# EAGLE design CrowPanel ESP32 Display-2.9(E) Inch (EAGLE 9.6.2)
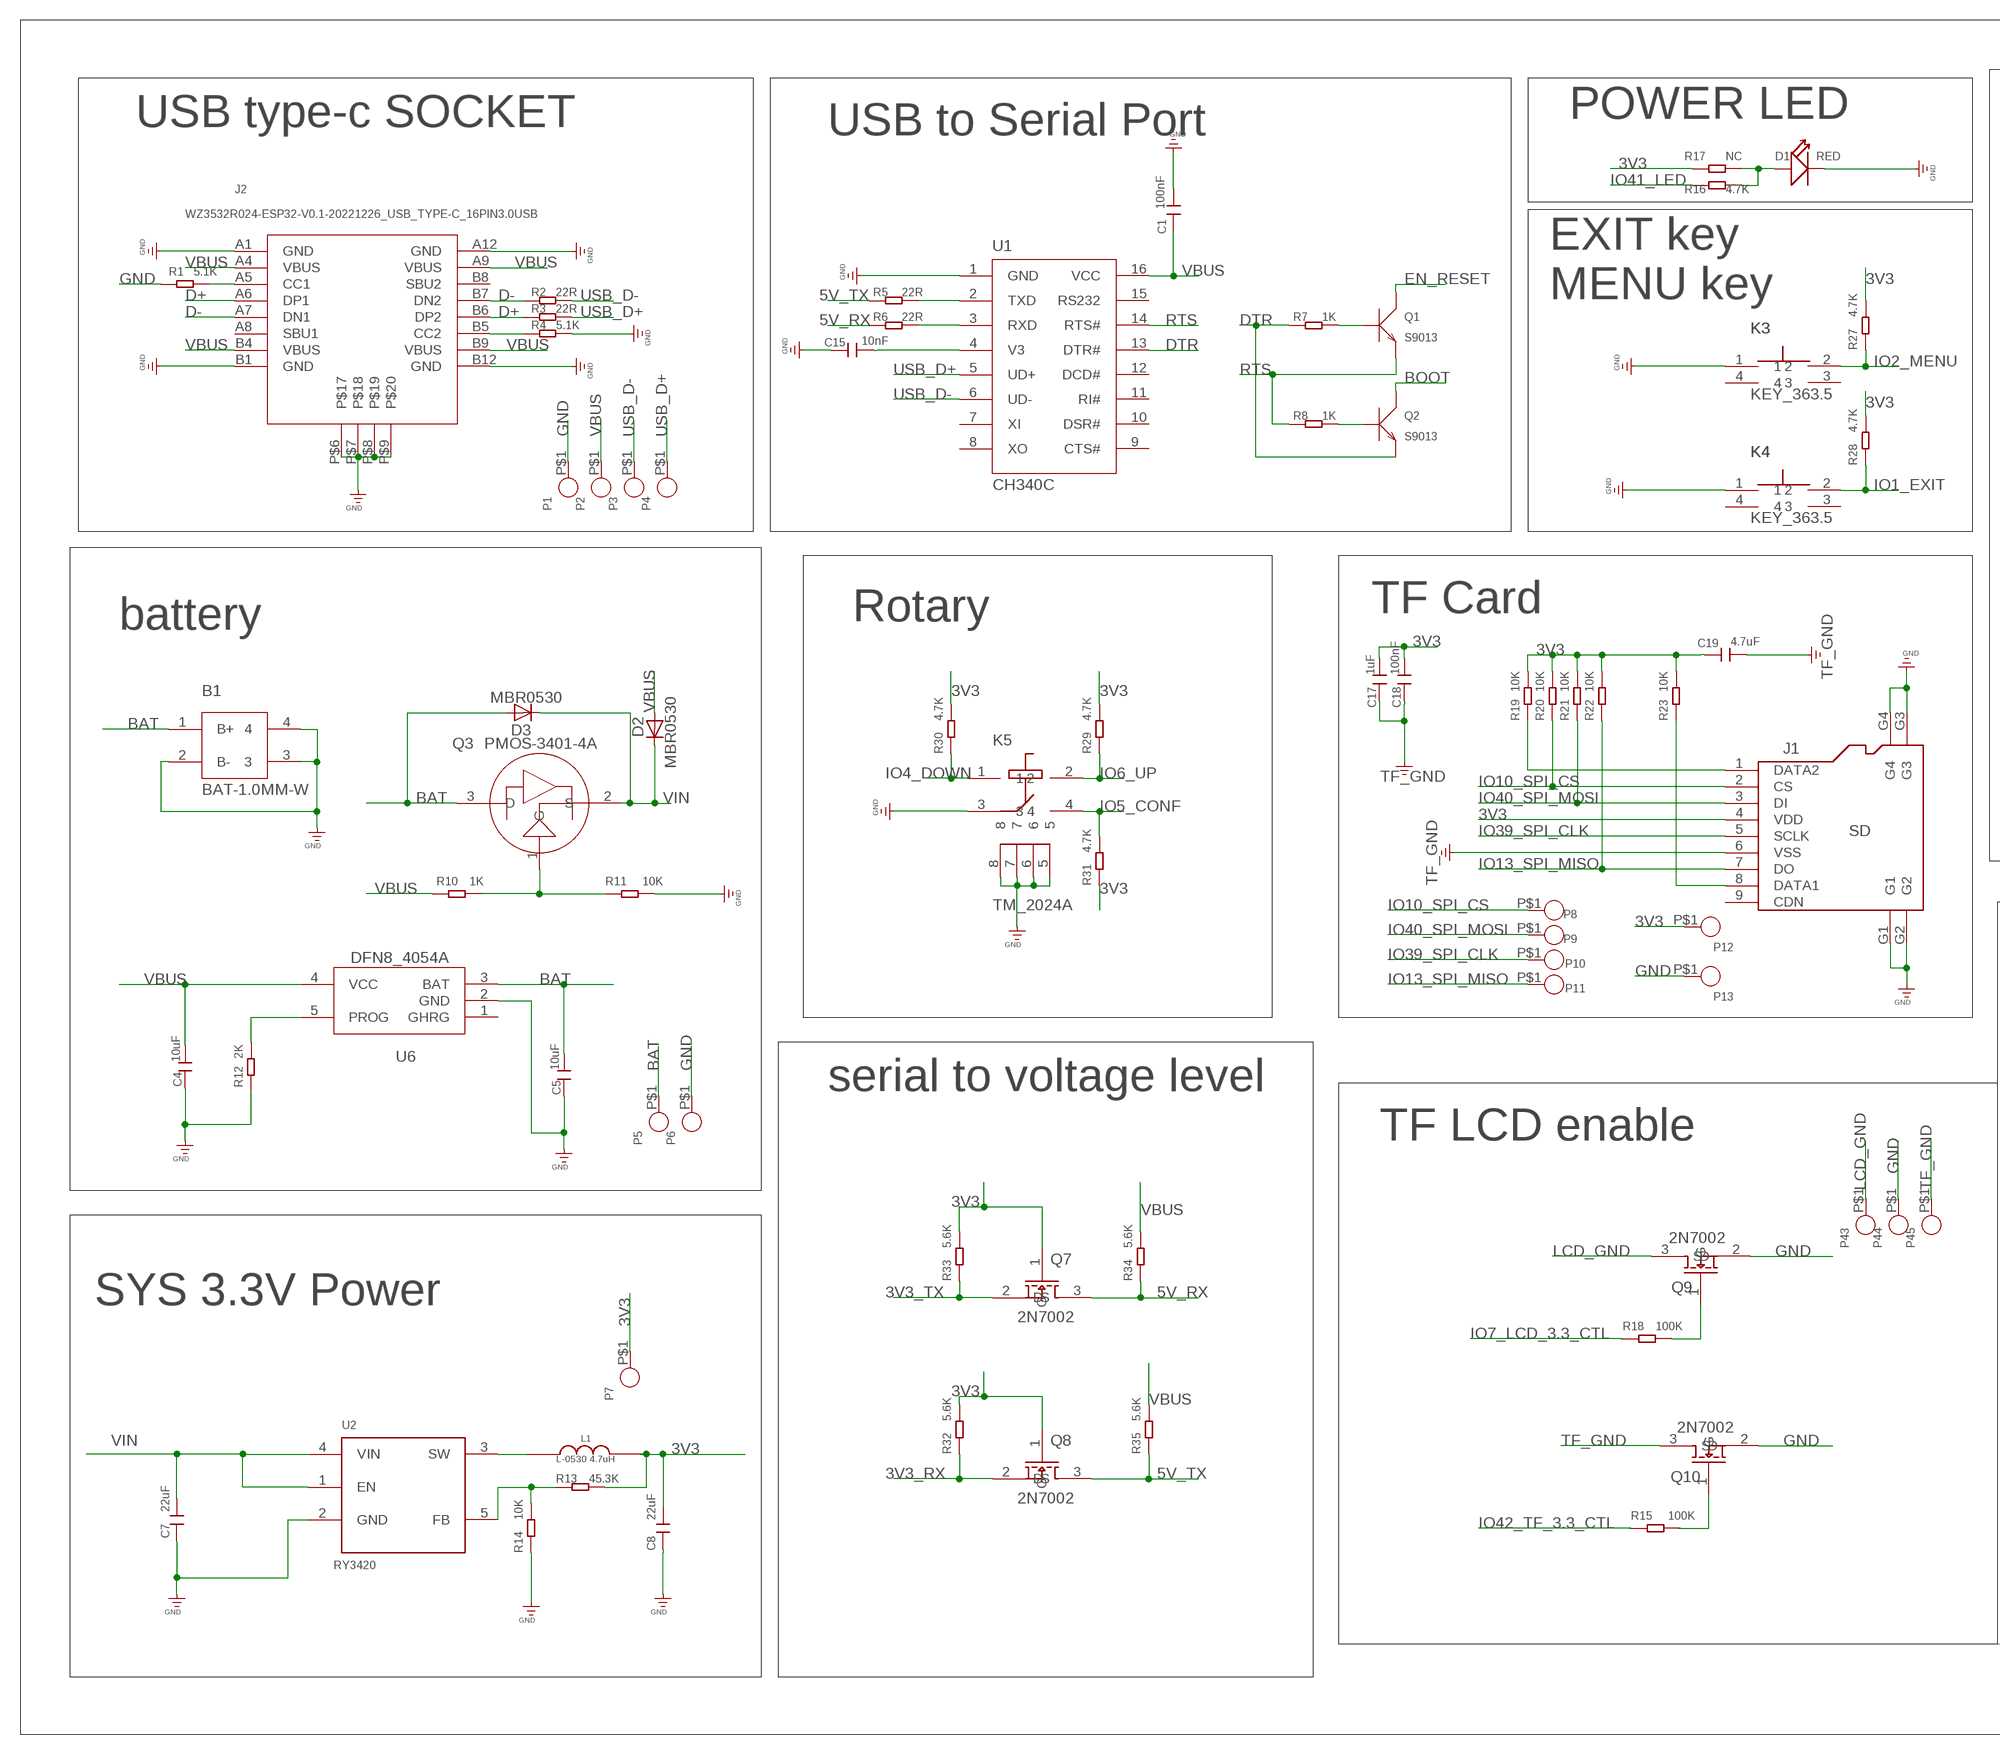
[diagram p0: schematic, sheet 1, part 1 of 2]
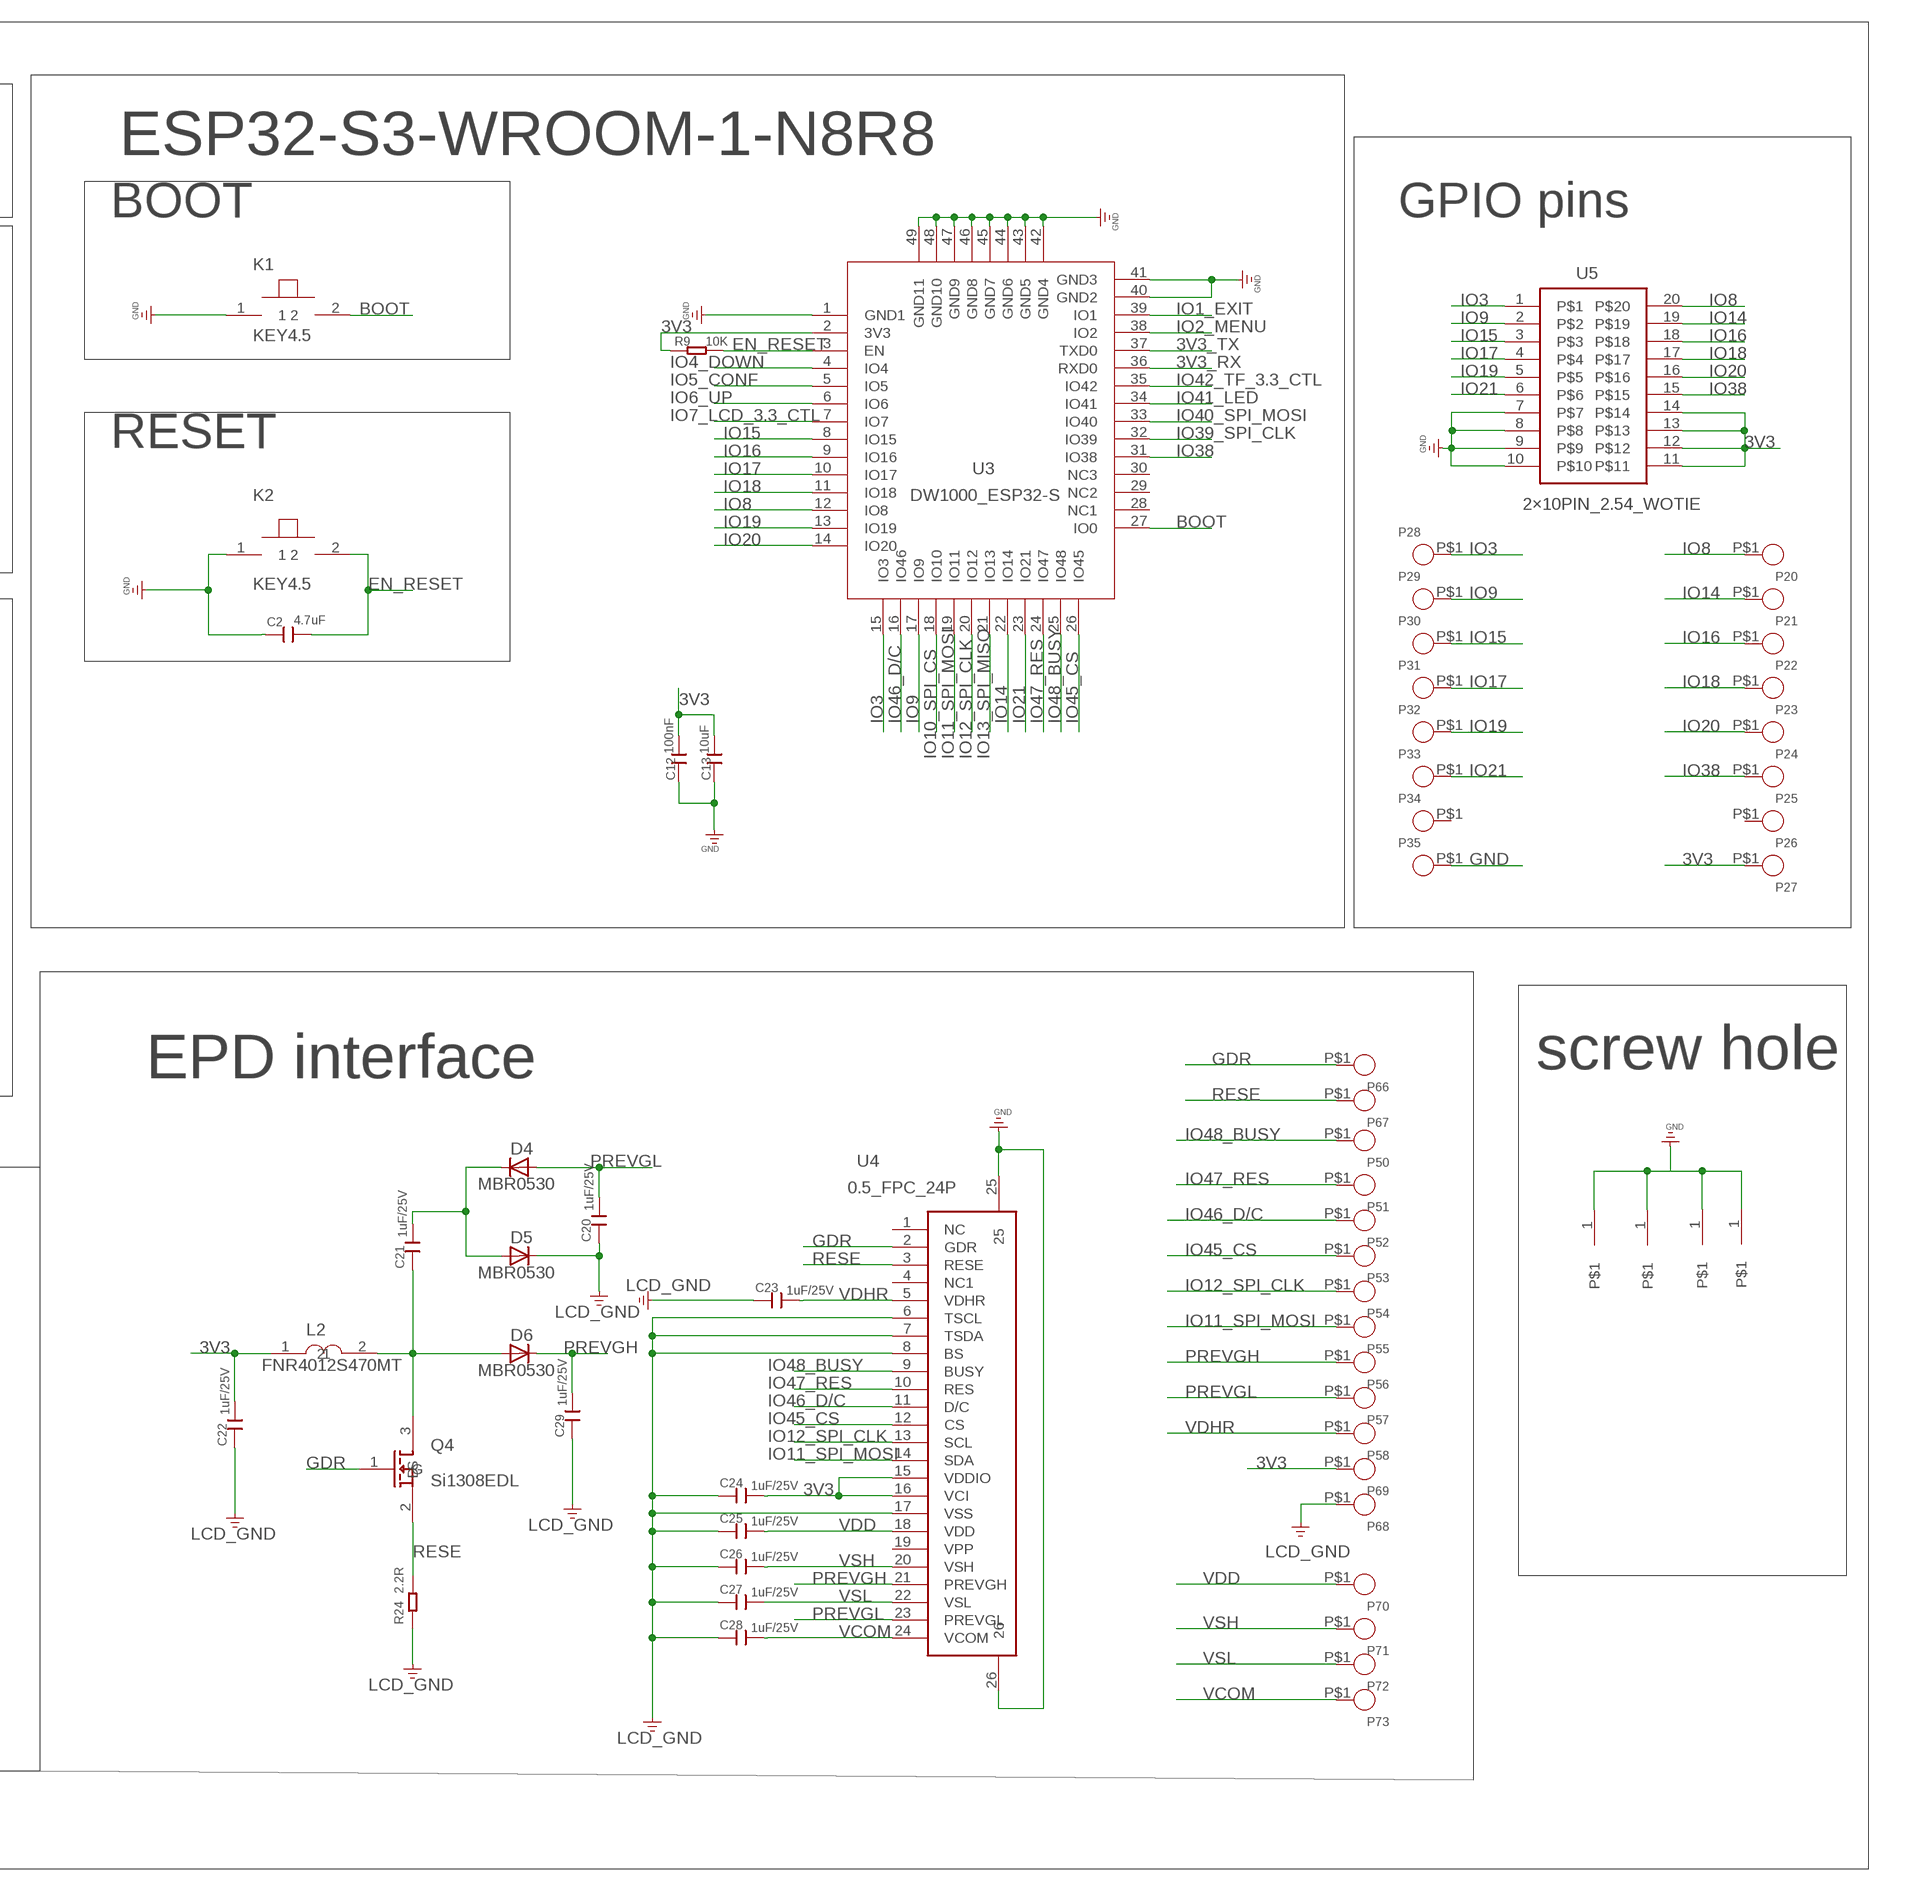
[diagram p1: schematic, sheet 1, part 2 of 2]

## Parts
B1  BAT-1.0MM-W  [SH1.0MM-W]
C1  100nF  C0402_W  [0402]
C2  4.7uF  C0402_W  [0402]
C4  10uF  C0402_W  [0402]
C5  10uF  C0402_W  [0402]
C7  22uF  C0603  [0603]
C8  22uF  C0603  [0603]
C12  100nF  C0402_W  [0402]
C13  10uF  C0402_W  [0402]
C15  10nF  C0402_W  [0402]
C17  1uF  C0402_W  [0402]
C18  100nF  C0402_W  [0402]
C19  4.7uF  C0402_W  [0402]
C20  1uF/25V  C0402_W  [0402]
C21  1uF/25V  C0402_W  [0402]
C22  1uF/25V  C0402_W  [0402]
C23  1uF/25V  C0402_W  [0402]
C24  1uF/25V  C0402_W  [0402]
C25  1uF/25V  C0402_W  [0402]
C26  1uF/25V  C0402_W  [0402]
C27  1uF/25V  C0402_W  [0402]
C28  1uF/25V  C0402_W  [0402]
C29  1uF/25V  C0402_W  [0402]
D1  RED  A_XBJ_DISCRETE_LED0603  [A_XBJ_DISCRETE_LED-0603]
D2  MBR0530  DIODE_DIODE-SOD123  [DIODE_SOD123]
D3  MBR0530  DIODE_DIODE-SOD123  [DIODE_SOD123]
D4  MBR0530  DIODE_DIODE-SOD123  [DIODE_SOD123]
D5  MBR0530  DIODE_DIODE-SOD123  [DIODE_SOD123]
D6  MBR0530  DIODE_DIODE-SOD123  [DIODE_SOD123]
H1  DW1000_3.2MM-5  [DW1000_3.2MM-5]
H2  DW1000_3.2MM-5  [DW1000_3.2MM-5]
H3  DW1000_3.2MM-5  [DW1000_3.2MM-5]
H4  DW1000_3.2MM-5  [DW1000_3.2MM-5]
J1  SD  CONNECTOR_HOLDER-MICROSD-9P  [CONNECTOR_9P-SMD-W/-RING]
J2  WZ3532R024-ESP32-V0.1-20221226_USB_TYPE-C_16PIN3.0USB  [WZ3532R024-ESP32-V0.1-20221226_KEVIN_3.0TYPEC-SMD]
K1  KEY4.5  [KEY-4.5]
K2  KEY4.5  [KEY-4.5]
K3  KEY_363.5  [KEY_3*6*3.5]
K4  KEY_363.5  [KEY_3*6*3.5]
K5  TM_2024A  [TM_2024A]
L1  L-0530 4.7uH  L-0530  [L0530]
L2  FNR4012S470MT  [FNR4012S470MT]
P1  CROWPI_POW_PADPAD-1.0MM  [CROWPI_POW_PAD-1.0MM]
P2  CROWPI_POW_PADPAD-1.0MM  [CROWPI_POW_PAD-1.0MM]
P3  CROWPI_POW_PADPAD-1.0MM  [CROWPI_POW_PAD-1.0MM]
P4  CROWPI_POW_PADPAD-1.0MM  [CROWPI_POW_PAD-1.0MM]
P5  CROWPI_POW_PADPAD-1.0MM  [CROWPI_POW_PAD-1.0MM]
P6  CROWPI_POW_PADPAD-1.0MM  [CROWPI_POW_PAD-1.0MM]
P7  CROWPI_POW_PADPAD-1.0MM  [CROWPI_POW_PAD-1.0MM]
P8  CROWPI_POW_PADPAD-1.0MM  [CROWPI_POW_PAD-1.0MM]
P9  CROWPI_POW_PADPAD-1.0MM  [CROWPI_POW_PAD-1.0MM]
P10  CROWPI_POW_PADPAD-1.0MM  [CROWPI_POW_PAD-1.0MM]
P11  CROWPI_POW_PADPAD-1.0MM  [CROWPI_POW_PAD-1.0MM]
P12  CROWPI_POW_PADPAD-1.0MM  [CROWPI_POW_PAD-1.0MM]
P13  CROWPI_POW_PADPAD-1.0MM  [CROWPI_POW_PAD-1.0MM]
P20  CROWPI_POW_PADPAD-1.0MM  [CROWPI_POW_PAD-1.0MM]
P21  CROWPI_POW_PADPAD-1.0MM  [CROWPI_POW_PAD-1.0MM]
P22  CROWPI_POW_PADPAD-1.0MM  [CROWPI_POW_PAD-1.0MM]
P23  CROWPI_POW_PADPAD-1.0MM  [CROWPI_POW_PAD-1.0MM]
P24  CROWPI_POW_PADPAD-1.0MM  [CROWPI_POW_PAD-1.0MM]
P25  CROWPI_POW_PADPAD-1.0MM  [CROWPI_POW_PAD-1.0MM]
P26  CROWPI_POW_PADPAD-1.0MM  [CROWPI_POW_PAD-1.0MM]
P27  CROWPI_POW_PADPAD-1.0MM  [CROWPI_POW_PAD-1.0MM]
P28  CROWPI_POW_PADPAD-1.0MM  [CROWPI_POW_PAD-1.0MM]
P29  CROWPI_POW_PADPAD-1.0MM  [CROWPI_POW_PAD-1.0MM]
P30  CROWPI_POW_PADPAD-1.0MM  [CROWPI_POW_PAD-1.0MM]
P31  CROWPI_POW_PADPAD-1.0MM  [CROWPI_POW_PAD-1.0MM]
P32  CROWPI_POW_PADPAD-1.0MM  [CROWPI_POW_PAD-1.0MM]
P33  CROWPI_POW_PADPAD-1.0MM  [CROWPI_POW_PAD-1.0MM]
P34  CROWPI_POW_PADPAD-1.0MM  [CROWPI_POW_PAD-1.0MM]
P35  CROWPI_POW_PADPAD-1.0MM  [CROWPI_POW_PAD-1.0MM]
P43  CROWPI_POW_PADPAD-1.0MM  [CROWPI_POW_PAD-1.0MM]
P44  CROWPI_POW_PADPAD-1.0MM  [CROWPI_POW_PAD-1.0MM]
P45  CROWPI_POW_PADPAD-1.0MM  [CROWPI_POW_PAD-1.0MM]
P50  CROWPI_POW_PADPAD-1.0MM  [CROWPI_POW_PAD-1.0MM]
P51  CROWPI_POW_PADPAD-1.0MM  [CROWPI_POW_PAD-1.0MM]
P52  CROWPI_POW_PADPAD-1.0MM  [CROWPI_POW_PAD-1.0MM]
P53  CROWPI_POW_PADPAD-1.0MM  [CROWPI_POW_PAD-1.0MM]
P54  CROWPI_POW_PADPAD-1.0MM  [CROWPI_POW_PAD-1.0MM]
P55  CROWPI_POW_PADPAD-1.0MM  [CROWPI_POW_PAD-1.0MM]
P56  CROWPI_POW_PADPAD-1.0MM  [CROWPI_POW_PAD-1.0MM]
P57  CROWPI_POW_PADPAD-1.0MM  [CROWPI_POW_PAD-1.0MM]
P58  CROWPI_POW_PADPAD-1.0MM  [CROWPI_POW_PAD-1.0MM]
P66  CROWPI_POW_PADPAD-1.0MM  [CROWPI_POW_PAD-1.0MM]
P67  CROWPI_POW_PADPAD-1.0MM  [CROWPI_POW_PAD-1.0MM]
P68  CROWPI_POW_PADPAD-1.0MM  [CROWPI_POW_PAD-1.0MM]
P69  CROWPI_POW_PADPAD-1.0MM  [CROWPI_POW_PAD-1.0MM]
P70  CROWPI_POW_PADPAD-1.0MM  [CROWPI_POW_PAD-1.0MM]
P71  CROWPI_POW_PADPAD-1.0MM  [CROWPI_POW_PAD-1.0MM]
P72  CROWPI_POW_PADPAD-1.0MM  [CROWPI_POW_PAD-1.0MM]
P73  CROWPI_POW_PADPAD-1.0MM  [CROWPI_POW_PAD-1.0MM]
Q1  S9013  DISCRETE_TRANSISTOR-NPN-SOT23  [DISCRETE_SOT23$1]
Q2  S9013  DISCRETE_TRANSISTOR-NPN-SOT23  [DISCRETE_SOT23$1]
Q3  PMOS-3401-4A  DFN8_P-MOS-SOT23  [DFN8_SOT-23]
Q4  Si1308EDL  HXY2102EI  [SOT-323_W]
Q7  2N7002  NMOS_W  [SOT23-3_W]
Q8  2N7002  NMOS_W  [SOT23-3_W]
Q9  2N7002  NMOS_W  [SOT23-3_W]
Q10  2N7002  NMOS_W  [SOT23-3_W]
R1  5.1K  R0402-1  [0402]
R2  22R  R0402-1  [0402]
R3  22R  R0402-1  [0402]
R4  5.1K  R0402-1  [0402]
R5  22R  R0402-1  [0402]
R6  22R  R0402-1  [0402]
R7  1K  R0402-1  [0402]
R8  1K  R0402-1  [0402]
R9  10K  R0402-1  [0402]
R10  1K  R0402-1  [0402]
R11  10K  R0402-1  [0402]
R12  2K  R0402-1  [0402]
R13  45.3K  R0402-1  [0402]
R14  10K  R0402-1  [0402]
R15  100K  R0402-1  [0402]
R16  4.7K  A9G_DISCRETE_R-0603  [A9G_DISCRETE_R0603]
R17  NC  A9G_DISCRETE_R-0603  [A9G_DISCRETE_R0603]
R18  100K  R0402-1  [0402]
R19  10K  R0402-1  [0402]
R20  10K  R0402-1  [0402]
R21  10K  R0402-1  [0402]
R22  10K  R0402-1  [0402]
R23  10K  R0402-1  [0402]
R24  2.2R  R0402-1  [0402]
R27  4.7K  A9G_DISCRETE_R-0603  [A9G_DISCRETE_R0603]
R28  4.7K  A9G_DISCRETE_R-0603  [A9G_DISCRETE_R0603]
R29  4.7K  A9G_DISCRETE_R-0603  [A9G_DISCRETE_R0603]
R30  4.7K  A9G_DISCRETE_R-0603  [A9G_DISCRETE_R0603]
R31  4.7K  A9G_DISCRETE_R-0603  [A9G_DISCRETE_R0603]
R32  5.6K  R0402-1  [0402]
R33  5.6K  R0402-1  [0402]
R34  5.6K  R0402-1  [0402]
R35  5.6K  R0402-1  [0402]
U1  CH340C  A_XBJ_CH340G  [A_XBJ_SOP-16]
U2  RY3420  CROWBOT_-V1.0-20220525_A_XBJ_HM3420B  [CROWBOT_-V1.0-20220525_A_XBJ_SOT23-5]
U3  DW1000_ESP32-S  [DW1000_ESP32-S3]
U4  0.5_FPC_24P  [0.5_FPC_24P]
U5  2×10PIN_2.54_WOTIE  [2*10PIN_2.54_WOTIE]
U6  DFN8_4054A  [DFN8_SOP23-5]

## Nets
3V3: C8.2 C12.2 C13.2 C17.2 C18.2 C19.1 C22.1 C24.1 J1.4(VDD) L1.P$2 L2.1 P7.P$1 P12.P$1 P27.P$1 P69.P$1 Q7.1(G) Q8.1(G) R9.1 R13.2 R17.1 R19.2 R20.2 R21.2 R22.2 R23.2 R27.2 R28.2 R29.2 R30.2 R31.1 R32.2 R33.2 U3.2(3V3) U4.15(VDDIO) U4.16(VCI) U5.11 U5.12 U5.13 U5.14
3V3_RX: Q8.2(S) R32.1 U3.36(RXD0)
3V3_TX: Q7.2(S) R33.1 U3.37(TXD0)
5V_RX: Q7.3(D) R6.1 R34.1
5V_TX: Q8.3(D) R5.1 R35.1
BAT: B1.1(B+) C5.2 D3.A P5.P$1 Q3.3(D) U6.3(BAT)
BOOT: K1.2 Q2.3(C) U3.27(IO0)
D+: J2.A6(DP1) J2.B6(DP2) R3.1
D-: J2.A7(DN1) J2.B7(DN2) R2.1
DTR: Q2.2(E) R7.1 U1.13(DTR#)
EN_RESET: C2.2 K2.2 Q1.3(C) R9.2 U3.3(EN)
GDR: P66.P$1 Q4.1(G) U4.2(GDR)
GND: B1.2(B-) B1.3 B1.4 C1.2 C2.1 C4.1 C5.1 C7.1 C8.1 C12.1 C13.1 C15.1 D1.- H1.1 H2.1 H3.1 H4.1 J1.G1 J1.G2 J1.G3 J1.G4 J2.A1(GND) J2.A12(GND) J2.B1(GND) J2.B12(GND) J2.P$6 J2.P$7 J2.P$8 J2.P$9 K1.1 K2.1 K3.1 K4.1 K5.3 K5.5 K5.6 K5.7 K5.8 P1.P$1 P6.P$1 P13.P$1 P35.P$1 P44.P$1 Q9.2(S) Q10.2(S) R1.1 R4.2 R11.2 R12.1 R14.1 U1.1(GND) U2.2(GND) U3.1(GND1) U3.40(GND2) U3.41(GND3) U3.42(GND4) U3.43(GND5) U3.44(GND6) U3.45(GND7) U3.46(GND8) U3.47(GND9) U3.48(GND10) U3.49(GND11) U4.25 U4.26 U5.7 U5.8 U5.9 U5.10 U6.2(GND)
IO1_EXIT: K4.2 R28.1 U3.39(IO1)
IO2_MENU: K3.2 R27.1 U3.38(IO2)
IO3: P28.P$1 U3.15(IO3) U5.1
IO4_DOWN: K5.1 R30.1 U3.4(IO4)
IO5_CONF: K5.4 R31.2 U3.5(IO5)
IO6_UP: K5.2 R29.1 U3.6(IO6)
IO7_LCD_3.3_CTL: R18.1 U3.7(IO7)
IO8: P20.P$1 U3.12(IO8) U5.20
IO9: P29.P$1 U3.17(IO9) U5.2
IO10_SPI_CS: J1.2(CS) P8.P$1 R20.1 U3.18(IO10)
IO11_SPI_MOSI: P55.P$1 U3.19(IO11) U4.14(SDA)
IO12_SPI_CLK: P54.P$1 U3.20(IO12) U4.13(SCL)
IO13_SPI_MISO: J1.7(DO) P11.P$1 R22.1 U3.21(IO13)
IO14: P21.P$1 U3.22(IO14) U5.19
IO15: P30.P$1 U3.8(IO15) U5.3
IO16: P22.P$1 U3.9(IO16) U5.18
IO17: P31.P$1 U3.10(IO17) U5.4
IO18: P23.P$1 U3.11(IO18) U5.17
IO19: P32.P$1 U3.13(IO19) U5.5
IO20: P24.P$1 U3.14(IO20) U5.16
IO21: P33.P$1 U3.23(IO21) U5.6
IO38: P25.P$1 U3.31(IO38) U5.15
IO39_SPI_CLK: J1.5(SCLK) P10.P$1 U3.32(IO39)
IO40_SPI_MOSI: J1.3(DI) P9.P$1 R21.1 U3.33(IO40)
IO41_LED: R16.1 U3.34(IO41)
IO42_TF_3.3_CTL: R15.1 U3.35(IO42)
IO45_CS: P53.P$1 U3.26(IO45) U4.12(CS)
IO46_D/C: P52.P$1 U3.16(IO46) U4.11(D/C)
IO47_RES: P51.P$1 U3.24(IO47) U4.10(RES)
IO48_BUSY: P50.P$1 U3.25(IO48) U4.9(BUSY)
LCD_GND: C20.2 C22.2 C23.2 C24.2 C25.2 C26.2 C27.2 C28.2 C29.2 D5.C P43.P$1 P68.P$1 Q9.3(D) R24.1 U4.6(TSCL) U4.7(TSDA) U4.8(BS) U4.17(VSS) ; supply symbol labelled GND
N$1: Q1.1(B) R7.2
N$2: R5.2 U1.2(TXD)
N$3: R6.2 U1.3(RXD)
N$4: Q2.1(B) R8.2
N$5: J2.A5(CC1) R1.2
N$6: Q3.1(G) R10.2 R11.1
N$7: Q9.1(G) R18.2
N$8: Q10.1(G) R15.2
N$9: R13.1 R14.2 U2.5(FB)
N$10: J1.1(DATA2) R19.1
N$11: L1.P$1 U2.3(SW)
N$12: J2.B5(CC2) R4.1
N$13: C15.2 U1.4(V3)
N$16: R12.2 U6.5(PROG)
N$20: J1.8(DATA1) R23.1
N$25: D1.+ R16.2 R17.2
N$55: C21.1 D4.C D5.A
N$56: C21.2 D6.A L2.2 Q4.3(D)
PREVGH: C29.1 D6.C P56.P$1 U4.21(PREVGH)
PREVGL: C20.1 D4.A P57.P$1 U4.23(PREVGL)
RESE: P67.P$1 Q4.2(S) R24.2 U4.3(RESE)
RTS: Q1.2(E) R8.1 U1.14(RTS#)
TF_GND: C17.1 C18.1 C19.2 J1.6(VSS) P45.P$1 Q10.3(D) ; supply symbol labelled GND
USB_D+: P4.P$1 R3.2 U1.5(UD+)
USB_D-: P3.P$1 R2.2 U1.6(UD-)
VBUS: C1.1 C4.2 D2.A J2.A4(VBUS) J2.A9(VBUS) J2.B4(VBUS) J2.B9(VBUS) P2.P$1 R10.1 R34.2 R35.2 U1.16(VCC) U6.4(VCC)
VCOM: C28.1 P73.P$1 U4.24(VCOM)
VDD: C25.1 P70.P$1 U4.18(VDD)
VDHR: C23.1 P58.P$1 U4.5(VDHR)
VIN: C7.2 D2.C D3.C Q3.2(S) U2.1(EN) U2.4(VIN)
VSH: C26.1 P71.P$1 U4.20(VSH)
VSL: C27.1 P72.P$1 U4.22(VSL)
Unconnected: J1.9(CDN) J2.A8(SBU1) J2.B8(SBU2) K3.3 K3.4 K4.3 K4.4 P26.P$1 P34.P$1 U1.7(XI) U1.8(XO) U1.9(CTS#) U1.10(DSR#) U1.11(RI#) U1.12(DCD#) U1.15(RS232) U3.28(NC1) U3.29(NC2) U3.30(NC3) U4.1(NC) U4.4(NC1) U4.19(VPP) U6.1(GHRG)

## Notes on the sheet
- USB type-c SOCKET | POWER LED
- USB to Serial Port | ESP32-S3-WROOM-1-N8R8
- BOOT | GPIO pins
- EXIT key
  MENU key
- RESET
- Rotary | TF Card
- battery
- EPD interface | screw hole
- serial to voltage level
- TF LCD enable
- SYS 3.3V Power

## Library data of the parts
B1 = WGH:BAT-1.0MM-W
C1 C2 C4 C5 C12 C13 C15 C17-C29 = WGH:C0402_W
C7 C8 = WGH:C0603
D1 = CrowPanel ESP32 Display-4.3-inch-V2.1-20240314:A_XBJ_DISCRETE_LED*
D2-D6 = CrowPanel ESP32 Display-4.3-inch-V2.1-20240314:DIODE_DIODE-: DIODE
H1-H4 = ESP32 Terminal - 3.5 Inch_2.0:DW1000_3.2MM-5
J1 = CrowPanel ESP32 Display-4.3-inch-V2.1-20240314:CONNECTOR_HOLDER-MICROSD-9P
J2 = CrowPanel ESP32 Display-4.3-inch-V2.1-20240314:WZ3532R024-ESP32-V0.1-20221226_USB_TYPE-C_16PIN
K1 K2 = WGH:KEY4.5
K3 K4 = WGH:KEY_3*6*3.5
K5 = WGH:TM_2024A
L1 = CrowPanel ESP32 Display-4.3-inch-V2.1-20240314:L-0530
L2 = WGH:FNR4012S470MT
P1-P13 P20-P35 P43-P45 P50-P58 P66-P73 = ESP32 Terminal - 3.5 Inch_2.0:CROWPI_POW_PAD*
Q1 Q2 = CrowPanel ESP32 Display-4.3-inch-V2.1-20240314:DISCRETE_TRANSISTOR-NPN*: NPN audion
Q3 = CrowPanel ESP32 Display-4.3-inch-V2.1-20240314:DFN8_P-MOS-SOT23
Q4 = WGH:HXY2102EI
Q7-Q10 = WGH:NMOS_W
R1-R15 R18-R24 R32-R35 = WGH:R0402-1
R16 R17 R27-R31 = CrowPanel ESP32 Display-4.3-inch-V2.1-20240314:A9G_DISCRETE_R*
U1 = CrowPanel ESP32 Display-4.3-inch-V2.1-20240314:A_XBJ_CH340G
U2 = CrowPanel ESP32 Display-4.3-inch-V2.1-20240314:CROWBOT_-V1.0-20220525_A_XBJ_HM3420B
U3 = CrowPanel ESP32 Display-4.3-inch-V2.1-20240314:DW1000_ESP32-S
U4 = ESP32 Terminal - 3.5 Inch_2.0:0.5_FPC_24P
U5 = WGH:2×10PIN_2.54_WOTIE
U6 = CrowPanel ESP32 Display-4.3-inch-V2.1-20240314:DFN8_4054A

## Net classes
0 default: width 0.254 mm, drill 0.305 mm, clearance 0.152 mm

## Board
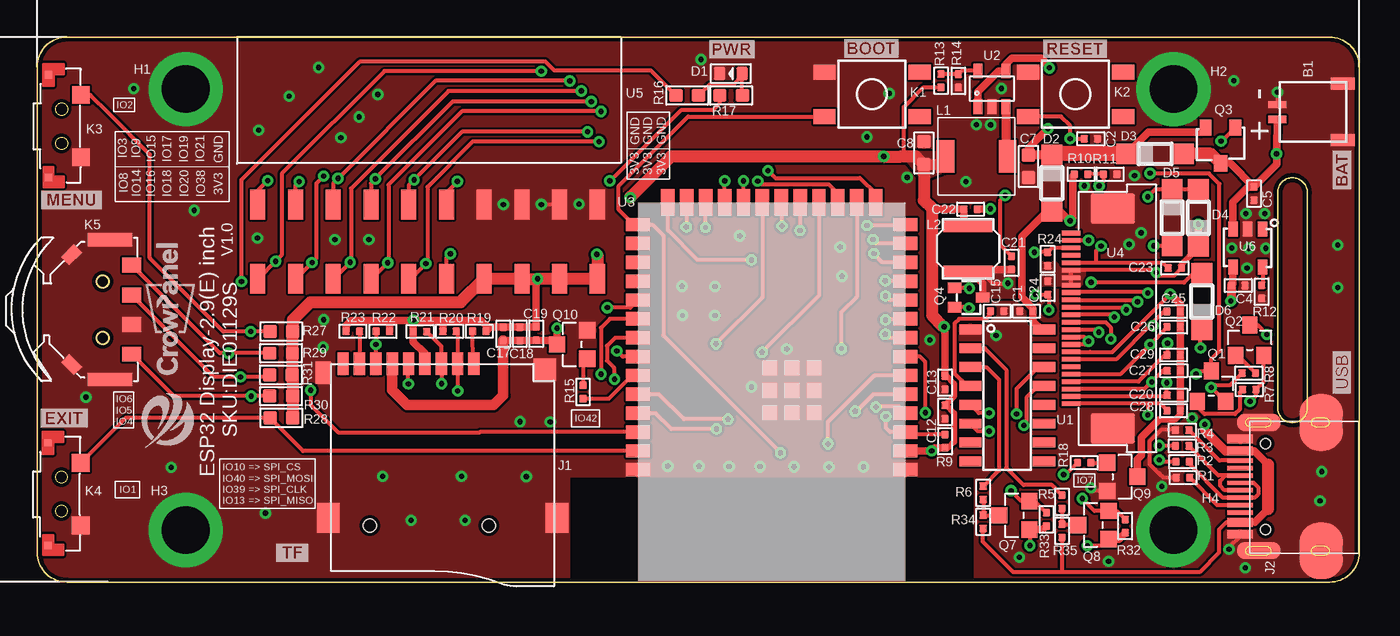
[diagram p2: board, top side]
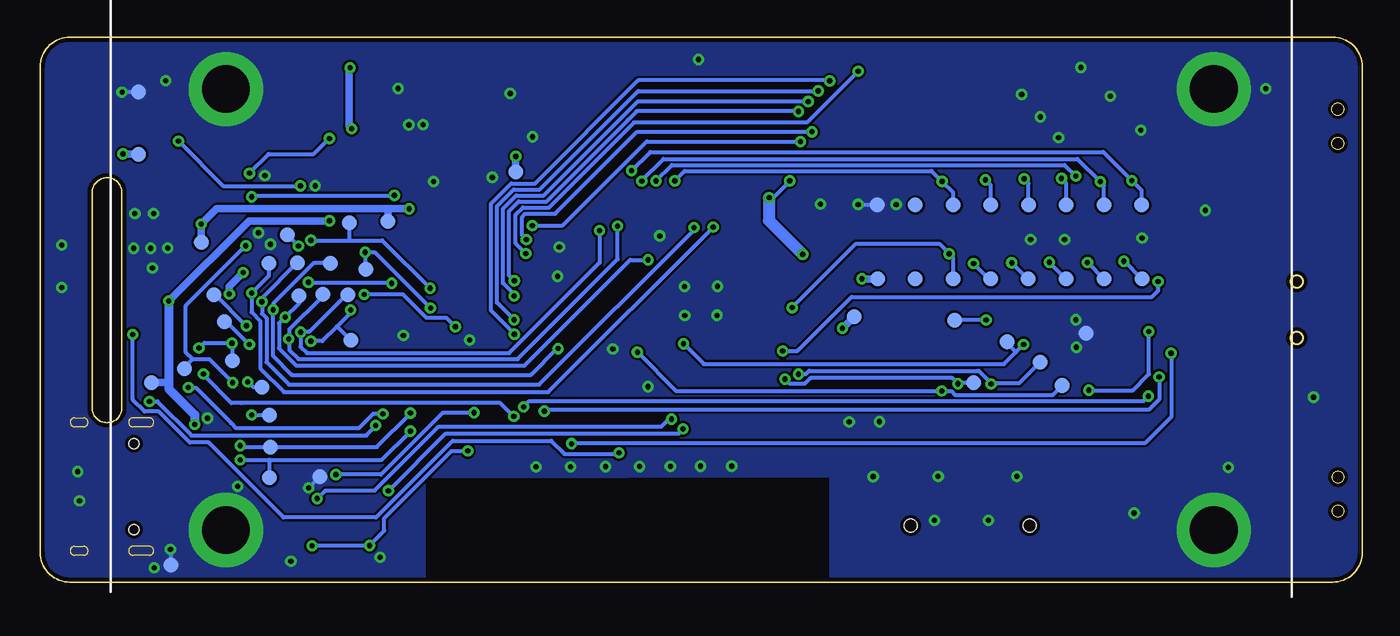
[diagram p3: board, bottom side, seen from below]

Size 89 x 36.7 mm. Coordinates in mm from the lower left corner, seen from the top.
Outline: 87,36.7 2,36.7 arc90 0,34.7 0,2 arc90 2,0 87.01,0 arc90 89,1.99 89,34.7 arc90 87,36.7
Outline: 85.5,11.73 85.5,26.22 arc90 84.5,27.23 arc90 83.5,26.24 83.5,11.74 arc90 84.51,10.73 arc90 85.5,11.73
Copper layers (1*16): Top 0.035mm / dielectric 1.5mm / Bottom 0.035mm
Design rules "default *": minimum track width 6mil, minimum drill 0.35mm, track to track 6mil, track to pad 6mil, pad to pad 6mil, via to via 6mil, smd to smd 6mil, copper to edge 10mil, drill to drill 6mil, minimum pad ring 10mil, minimum via ring 8mil, stop-mask expansion 4mil, vias tented up to drill 100mil, thermal gap 0mil

### Footprints (pad centres in the part's own frame; a part is rotated, then mirrored left to right if it is on the bottom)
SH1.0MM-W = smd 0.5 x 1.2: 1 -0.5,2.4; 2 0.5,2.4 | smd 0.8 x 1.6: 3 -1.9,-2; 4 1.9,-2
0402 = smd 0.5 x 0.5: 1 -0.45,0; 2 0.45,0
0603 = smd 0.889 x 0.889: 1 -0.762,0; 2 0.762,0
A_XBJ_DISCRETE_LED-0603 = smd 0.762 x 0.889: + -0.762,0; - 0.762,0
DIODE_SOD123 = smd 1.4 x 1.4: A 1.9,0; C -1.9,0
DW1000_3.2MM-5 = drill 3.2 pad 5: 1 0,0
CONNECTOR_9P-SMD-W/-RING = smd 1.524 x 0.762: 1 0,4.4; 2 0,3.3; 3 0,2.2; 4 0,1.1; 5 0,0; 6 0,-1.1; 7 0,-2.2; 8 0,-3.3; 9 0,-4.4 | smd 1.524 x 1.016: G1 0.6,-5.746 | smd 2.032 x 1.524: G2 10.373,-5.4; G3 10.373,10 | smd 1.524 x 1.524: G4 0.392,9.181 | hole 0.889: 10.9,-2.6; 10.9,5.4
WZ3532R024-ESP32-V0.1-20221226_KEVIN_3.0TYPEC-SMD = smd 0.3 x 1.7: A1 -3.35,0.5; A4 -2.55,0.5; A5 -1.25,0.5; A6 -0.25,0.5; A7 0.25,0.5; A8 1.25,0.5; A9 2.55,0.5; A12 3.35,0.5; B1 3.05,0.5; B4 2.25,0.5; B5 1.75,0.5; B6 0.75,0.5; B7 -0.75,0.5; B8 -1.75,0.5; B9 -2.25,0.5; B12 -3.05,0.5 | smd 1.143 x 2.921: P$6 -4.318,-0.762; P$7 4.318,-0.762 | smd 3.81 x 2.921: P$8 -4.318,-4.953; P$9 4.318,-4.953 | hole 0.68: -2.89,-1.22; 2.89,-1.22
KEY-4.5 = smd 1.5 x 1: 1 -3.2,1.5; 2 -3.2,-1.5; 3 3.2,-1.5; 4 3.2,1.5
KEY_3*6*3.5 = smd 1.2 x 1.2: 1 -2.1,-2.6; 2 2.1,-2.6 | smd 0.5 x 0.5: 3 3.45,-0.4; 4 -3.45,-0.4
TM_2024A = smd 1 x 1.3: 1 -3,0.65; 2 3,0.65; 3 -1,0.65; 4 1,0.65 | smd 0.9 x 3: 5 -4.7,2.1; 6 4.7,2.1 | smd 1.2 x 0.8 rotated 45: 7 -3.7,4.7 | smd 1.2 x 0.8 rotated 135: 8 3.7,4.7
L0530 = smd 1.2 x 2.2: P$1 -2.1,0; P$2 2.1,0
FNR4012S470MT = smd 0.95 x 3.3: 1 -1.6,0; 2 1.6,0
CROWPI_POW_PAD-1.0MM = smd 1 x 1: P$1 0,0
DISCRETE_SOT23$1 = smd 1.016 x 1.143: 1 -0.95,-1.016; 2 0.95,-1.016; 3 0,1.016
DFN8_SOT-23 = smd 1.1 x 0.8: 1 1.2,-1; 2 1.2,1 | smd 1.1 x 0.9: 3 -1.2,0
SOT-323_W = smd 0.7 x 0.9: 1 -0.65,-0.95; 2 0.65,-0.95; 3 0,0.95
SOT23-3_W = smd 1.1 x 1.1: 1 -0.95,-1.016; 2 0.95,-1.016; 3 0,1.016
A9G_DISCRETE_R0603 = smd 0.889 x 0.889: 1 -0.762,0; 2 0.762,0
A_XBJ_SOP-16 = smd 0.66 x 1.5: 1 -4.445,-2.475; 2 -3.175,-2.475; 3 -1.905,-2.475; 4 -0.635,-2.475; 5 0.635,-2.475; 6 1.905,-2.475; 7 3.175,-2.475; 8 4.445,-2.475; 9 4.445,2.475; 10 3.175,2.475; 11 1.905,2.475; 12 0.635,2.475; 13 -0.635,2.475; 14 -1.905,2.475; 15 -3.175,2.475; 16 -4.445,2.475
CROWBOT_-V1.0-20220525_A_XBJ_SOT23-5 = smd 0.6 x 1: 1 -0.95,-1.2; 2 0,-1.2; 3 0.95,-1.2; 4 0.95,1.2; 5 -0.95,1.2
DW1000_ESP32-S3 = smd 1.6 x 0.9: 1 0,18.01; 2 0,16.74; 3 0,15.47; 4 0,14.2; 5 0,12.93; 6 0,11.66; 7 0,10.39; 8 0,9.12; 9 0,7.85; 10 0,6.58; 11 0,5.31; 12 0,4.04; 13 0,2.77; 14 0,1.5; 27 18,1.5; 28 18,2.77; 29 18,4.04; 30 18,5.31; 31 18,6.58; 32 18,7.85; 33 18,9.12; 34 18,10.39; 35 18,11.66; 36 18,12.93; 37 18,14.2; 38 18,15.47; 39 18,16.74; 40 18,18.01 | smd 0.9 x 1.8: 15 2,0; 16 3.28,0; 17 4.55,0; 18 5.82,0; 19 7.09,0; 20 8.36,0; 21 9.63,0; 22 10.9,0; 23 12.17,0; 24 13.44,0; 25 14.71,0; 26 16,0 | smd 1 x 1: 41 7.64,11.16; 42 9.14,11.16; 43 6.14,11.16; 44 6.14,14.16; 45 7.64,12.66; 46 9.14,12.66; 47 7.64,14.16; 48 9.14,14.16; 49 6.14,12.66
0.5_FPC_24P = smd 1.3 x 0.3: 1 -2.54,5.75; 2 -2.54,5.25; 3 -2.54,4.75; 4 -2.54,4.25; 5 -2.54,3.75; 6 -2.54,3.25; 7 -2.54,2.75; 8 -2.54,2.25; 9 -2.54,1.75; 10 -2.54,1.25; 11 -2.54,0.75; 12 -2.54,0.25; 13 -2.54,-0.25; 14 -2.54,-0.75; 15 -2.54,-1.25; 16 -2.54,-1.75; 17 -2.54,-2.25; 18 -2.54,-2.75; 19 -2.54,-3.25; 20 -2.54,-3.75; 21 -2.54,-4.25; 22 -2.54,-4.75; 23 -2.54,-5.25; 24 -2.54,-5.75 | smd 3 x 2: 25 0.27,-7.4; 26 0.27,7.4
2*10PIN_2.54_WOTIE = smd 1.02 x 2: 1 1.4,-7; 2 3.94,-7; 3 6.48,-7; 4 9.02,-7; 5 11.56,-7; 6 14.1,-7; 7 16.64,-7; 8 19.18,-7; 9 21.72,-7; 10 24.26,-7; 11 24.26,-12; 12 21.72,-12; 13 19.18,-12; 14 16.64,-12; 15 14.1,-12; 16 11.56,-12; 17 9.02,-12; 18 6.48,-12; 19 3.94,-12; 20 1.4,-12
DFN8_SOP23-5 = smd 1 x 0.635: 1 -1.27,1; 2 -1.27,0; 3 -1.27,-1; 4 1.27,-1; 5 1.27,1

### Placement (x,y rotation side)
B1  85.89,31.65 90 top
C1  66.59,18.24 180 top
C2  70.93,29.85 180 top
C4  80.85,19.97 180 top
C5  81.91,26.16 90 top
C7  66.73,27.99 90 top
C8  59.69,28.89 270 top
C12  61.11,11.45 90 top
C13  61.11,13.43 90 top
C15  64.62,18.24 180 top
C17  31.38,16.72 90 top
C18  32.49,16.72 90 top
C19  33.59,16.73 270 top
C20  76.51,12.58 0 top
C21  65.59,21.5 270 top
C22  62.83,25.11 0 top
C23  76.58,21.15 0 top
C24  68.03,19.81 90 top
C25  76.5,18.22 0 top
C26  76.5,17.18 0 top
C27  76.51,14.23 0 top
C28  76.5,11.53 0 top
C29  76.5,15.29 0 top
D1  46.7,34.24 180 top
D2  68.3,26.86 270 top
D3  75.26,28.84 0 top
D4  76.4,24.55 270 top
D5  78.17,24.53 90 top
D6  78.39,18.89 90 top
H1  10,33.2 0 top
H2  76.5,33.2 0 top
H3  10,3.5 0 top
H4  76.5,3.5 0 top
J1  25,14.7 270 top
J2  81.48,6.43 90 top
K1  56.2,32.85 0 top
K2  69.9,32.85 0 top
K3  KEY_36*3.5  [KEY_3*6*3.5]  0.35,30.7 90 top
K4  KEY_36*3.5  [KEY_3*6*3.5]  0.33,5.92 90 top
K5  7.01,18.34 90 top
L1  63.23,28.66 180 top
L2  62.66,22.44 270 top
P1  80.21,1.15 270 bottom
P2  81.5,13.41 0 bottom
P3  73.56,7.02 0 bottom
P4  73.5,9.08 0 bottom
P5  82.38,28.81 0 bottom
P6  82.4,33.02 0 bottom
P7  56.99,27.63 0 bottom
P8  20.22,13.24 0 bottom
P9  26.17,13.42 0 bottom
P10  21.68,14.81 0 bottom
P11  23.91,16.18 0 bottom
P12  27.45,17.64 0 bottom
P13  18.59,16.74 0 bottom
P20  14.84,20.41 0 bottom
P21  17.39,20.41 0 bottom
P22  19.93,20.41 0 bottom
P23  22.49,20.41 0 bottom
P24  25.01,20.41 0 bottom
P25  27.54,20.41 0 bottom
P26  30.09,20.41 0 bottom
P27  32.64,20.41 0 bottom
P28  14.85,25.39 0 bottom
P29  17.39,25.39 0 bottom
P30  19.93,25.39 0 bottom
P31  22.47,25.39 0 bottom
P32  25.01,25.39 0 bottom
P33  27.54,25.39 0 bottom
P34  30.09,25.39 0 bottom
P35  32.65,25.39 0 bottom
P43  65.59,24.3 0 bottom
P44  70.18,7.09 0 bottom
P45  34.22,17.88 0 bottom
P50  73.6,21.46 0 bottom
P51  71.7,21.51 0 bottom
P52  69.47,21.47 0 bottom
P53  71.58,19.27 180 bottom
P54  69.97,19.38 0 bottom
P55  68.3,19.34 0 bottom
P56  76.07,14.9 0 bottom
P57  79.3,14.36 0 bottom
P58  72.37,23.39 0 bottom
P66  68.2,24.2 0 bottom
P67  67.08,21.07 0 bottom
P68  78.16,22.88 0 bottom
P69  68.09,16.29 0 bottom
P70  77.32,19.36 0 bottom
P71  76.61,17.52 0 bottom
P72  74.06,13.11 0 bottom
P73  73.56,11.24 0 bottom
Q1  79.05,13.19 0 top
Q2  81.62,16.28 0 top
Q3  79.65,29.4 90 top
Q4  62.7,19.16 270 top
Q7  65.78,4.49 90 top
Q8  71.1,3.84 90 top
Q9  73.04,7.09 270 top
Q10  36.01,16 90 top
R1  77.13,7.04 0 top
R2  77.11,8.1 180 top
R3  77.08,9.17 180 top
R4  77.08,10.23 180 top
R5  68.99,5.4 90 top
R6  63.68,6.01 90 top
R7  81.59,12.96 180 top
R8  81.56,14.07 0 top
R9  61.11,9.49 90 top
R10  70.27,27.46 0 top
R11  72.23,27.46 0 top
R12  82.43,19.55 90 top
R13  60.85,33.76 270 top
R14  62.01,33.75 90 top
R15  36.75,12.8 90 top
R16  43.76,32.77 0 top
R17  46.71,32.77 0 top
R18  70.48,8.03 0 top
R19  29.76,16.89 0 top
R20  27.76,16.88 180 top
R21  25.77,16.87 180 top
R22  23.27,16.89 0 top
R23  21.25,16.89 180 top
R24  68.02,21.76 90 top
R27  16.44,16.87 0 top
R28  16.44,11.06 0 top
R29  16.42,15.41 0 top
R30  16.42,12.52 0 top
R31  16.4,13.96 180 top
R32  73.24,3.77 270 top
R33  67.94,4.22 270 top
R34  63.68,4.06 270 top
R35  68.99,3.45 270 top
U1  65.3,12.57 270 top
U2  64.27,33.22 0 top
U3  58.45,25.57 180 top
U4  72.13,17.75 0 top
U5  13.45,32.42 0 top
U6  81.49,22.49 270 top
U$30  [LOGO-1]  11.15,8.65 90 top
U$41  [LOGO-MIN]  10.48,14.96 90 top

### Tracks (layer width: path | path; a pad name or v marks a point on that pad's centre or on a via)
3V3  (via drill 0.35)
  Top 0.254: 60.25,25.11 60.25,25.14 | U4.16 70.55,15.99 v70.78,16.23 70.5,16.5 U4.15 | R17.1 45.95,32.22 45.5,31.77 43.33,31.77 38.58,27.02 v38.55,27.02 | v66.83,2.46 v66.84,2.47 66.84,3.5 Q7.1 | v70.69,2.44 71.6,2.44 72.05,2.89 Q8.1 | R29.2 17.2,15.43 | C13.2 | 61.33,9.04 R9.1 | v67.19,19.37 67.21,19.36 C24.1 68.1,19.29 v68.1,18.32 | 58.14,28.66 58.34,28.86 58.34,31.99 59.66,33.31 R13.2
  Top 0.4: C13.2 61.19,13.88 61.72,13.35 61.72,12.51 C12.2 61.19,11.9 61.72,11.37 61.72,9.43 61.33,9.04
  Top 0.5: R33.2 67.71,3.54 Q7.1 | R32.2 72.81,2.89 Q8.1 | 60.25,25.11 C22.1 62.38,24.32 L2.1 | C18.2 33.58,17.17 C19.1 33.59,20.33 v33.68,20.42 | C18.2 | C18.2 C17.2 30.49,17.17 | 30.49,17.17 R19.2 | 30.49,17.17 30.36,17.17 29.89,17.63 27.3,17.63 | 27.3,17.63 25.34,17.63 | 25.34,17.63 25.3,17.63 | v25.32,17.65 25.3,17.63 | 25.3,17.63 23.73,17.63 | v25.32,17.65 25.34,17.63 | 23.73,17.63 21.13,17.63 20.8,17.3 R23.2 | R22.2 23.72,17.62 23.73,17.63 | v25.32,17.65 R21.2 25.32,16.17 26.1,15.39 J1.4 | R20.2 27.31,17.62 27.3,17.63 | v61.05,17.19 61.11,17.13 C13.2 | R9.1 60.43,9.04 v60.22,8.83 U3.2
  Top 0.7: L1.P$2 60.6,28.13 C8.2
  Top 0.8: 60.25,25.11 60.25,17.96 61.02,17.19 v61.05,17.19 | v39.93,25.89 39.93,25.93 42.66,28.66 v56.98,28.66 58.14,28.66 59.16,28.66 C8.2 59.69,25.7 60.25,25.14 | v37.67,22.07 37.71,22.03 U5.11 U5.12 v33.68,20.42 U5.13 U5.14 28.52,18.85 18.4,18.85 17.2,17.65 R27.2 17.2,15.43 | R29.2 17.18,13.97 R31.1 17.19,13.94 R30.2 17.19,11.07 R28.2
  Bottom 0.254: v38.55,27.02 38.55,26.98 39.66,25.87 39.95,25.87 | v70.69,2.44 70.67,2.46 v66.83,2.46 65.84,3.45 65.84,4.3 61.32,8.82 v60.22,8.82 v60.22,8.83 | v67.19,19.37 64.58,19.37 63,17.79 61.65,17.79 v61.05,17.19 | v70.78,16.23 70.01,16.23 69.02,17.22 | v68.1,18.32 68.1,18.13 69.02,17.22 | P12.P$1 v25.32,17.65 | P69.P$1 69.02,17.22
  Bottom 0.5: v56.98,28.66 v56.99,28.65 P7.P$1 | P27.P$1 32.68,20.42 v33.68,20.42
  Bottom 0.8: v39.93,25.89 39.95,25.87 39.95,24.35 v37.67,22.07
  pour Top: 58.39,28.56 59.62,27.04 61.19,27.65 61.19,28.99 58.63,28.99
3V3_RX  (via drill 0.35)
  Top 0.254: R32.1 72.67,4.79 Q8.2 71.18,4.79 v70.35,5.62 | U3.36 41.86,12.64 43.53,10.97 v46.49,10.97 v46.5,10.96
  Bottom 0.254: v70.35,5.62 69.8,6.17 69.22,6.17 66.48,6.17 62.18,10.47 47.19,10.47 46.7,10.96 v46.5,10.96
3V3_TX  (via drill 0.35)
  Top 0.254: R33.1 67.17,5.44 Q7.2 66.27,5.44 v65.56,6.15 | v45.73,10.31 v45.72,10.3 42.7,10.3 41.63,11.37 U3.37
  Bottom 0.254: v65.56,6.15 61.7,10.01 46.03,10.01 v45.73,10.31
5V_RX
  Top 0.254: R6.1 R34.1 63.7,4.49 Q7.3
5V_TX
  Top 0.254: R5.1 R35.1 70.03,3.9 Q8.3
BAT  (via drill 0.35)
  Top 0.5: U6.3 80.49,25.59 81.51,26.61 C5.2 | B1.1 83.43,29.15 v83.43,28.83 83.43,28.13 C5.2 | C5.2 80.32,28.2 Q3.3
  Top 0.8: Q3.3 79.01,28.84 D3.A
  Bottom 0.5: P5.P$1 83.41,28.81 v83.43,28.83
BOOT  (via drill 0.35)
  Top 0.254: K1.2 43.82,31.35 39.14,26.67 39.14,25.08 40.15,24.07 U3.27 41.41,24.07 42.15,23.33 42.15,16.6 50.03,8.72 v50.03,8.7 | v82.78,16.68 82.16,17.3 Q2.3
  Bottom 0.254: v50.03,8.7 50.1,8.63 53.71,8.63 54.6,9.52 61.23,9.52 66.4,4.35 72.62,4.35 77.67,9.4 78.93,9.4 81.02,11.49 81.98,11.49 82.77,12.28 82.77,16.63 82.78,16.64 v82.78,16.68
D+
  Top 0.254: J2.A6 79.93,6.18 79.63,6.48 79.63,6.82 79.99,7.18 J2.B6 79.52,7.18 R3.1
D-
  Top 0.254: J2.A7 81.89,6.68 82.19,6.38 82.19,5.9 81.96,5.67 J2.B7 79.83,5.68 77.56,7.95 R2.1
DTR  (via drill 0.35)
  Top 0.254: U1.13 67.38,13.21 66.6,12.43 66.6,10.72 v66.42,10.54 | v81.65,12.17 82.02,12.54 82.02,12.94 R7.1 82.57,13.49 Q2.2
  Bottom 0.254: v81.65,12.17 81.12,12.17 78.81,9.86 76.86,9.86 67.06,9.86 66.42,10.5 v66.42,10.54
EN_RESET  (via drill 0.35)
  Top 0.254: v57.12,11.15 57.11,11.14 57.11,10.4 57.41,10.1 U3.3 58.61,9.94 R9.2 | v74.92,27.53 74.93,27.52 78.88,27.52 79.59,26.81 79.59,15.56 79.05,15.02 Q1.3 78.2,14.21 v78.01,14.02 | C2.2 69.56,29.85 v69.54,29.87 69.54,30.73 68.92,31.35 K2.2
  Bottom 0.254: v57.12,11.15 58.03,12.06 75.45,12.06 | 75.45,12.06 76.14,12.06 78.01,13.93 v78.01,14.02 | v74.92,27.53 73.63,28.82 70.59,28.82 v69.54,29.87 | 75.45,12.06
GDR  (via drill 0.35)
  Top 0.254: U4.2 v70.78,23.01 | v62.75,19.79 61.77,19.79 Q4.1
  Bottom 0.254: v62.75,19.79 65.97,23.01 68.18,23.01 | v70.78,23.01 68.18,23.01 | P66.P$1 68.2,23.03 68.18,23.01
GND  (via drill 0.35)
  Top 0.254: R4.2 75.66,10.24 74.88,9.46 74.88,7.96 75.54,7.3 | 75.54,7.3 | 75.54,7.3 75.8,7.04 R1.1 | J2.B12 J2.A1 80.23,2.33 v80.23,2.21 | v83.49,32.99 B1.2 | Q9.2 71.13,6.14 v70.93,6.34 | U5.9 v33.95,25.42 v33.94,25.43
  Bottom 0.254: v80.23,2.21 80.23,1.17 P1.P$1 | v83.49,32.99 83.46,33.02 P6.P$1 | v70.93,6.34 v70.93,6.35 P44.P$1 | v33.94,25.43 32.72,25.43 P35.P$1
  other vias: 21.68,31.33 22.94,32.84 77.74,11.03 62.52,26.97 75.71,6.44 73.88,27.37 74.31,23.52 19.28,17.66 19.24,15.82 23.25,7.11 28.56,7.11 60.09,16.3 50.46,15.7 42.45,7.81 55.62,7.76 63.22,30.8 64.19,30.79 36.48,25.46 32.5,10.8 34.54,10.79 64.9,33.24 64.56,16.61 81.33,0.96 31.38,25.43 16.97,32.72 6.49,33.22 10.57,25.03 3.28,12.45 9.02,7.73 15.36,4.64 44.69,35.2 57.36,32.9 55.85,29.98 66.12,1.66 72.12,1.4 58.57,27.26 20.44,29.92 32.93,7.1 70.5,26.68 14.91,30.44 18.95,34.66 25.18,4.15 28.8,4.15 86.47,7.44 86.36,5.47 87.56,19.83 87.56,22.69 80.56,33.76 48.09,13.16 43.41,19.92 43.44,17.96 45.63,19.91 45.61,17.95 73.5,22.75 44.55,7.8 46.58,7.79 48.65,7.78 50.95,7.77 53.3,7.76 14.82,23.17 20.04,23.07 22.33,23.07 47.3,23.31 54.06,22.56 54.17,20.59 81.37,24.81 82.63,24.81 81.56,22.48 80.41,22.49 82.7,22.48 81.45,21.15
  pour Bottom: -1.93,40.48 -1.93,-2.47 35.83,-2.51 35.84,7.07 63.08,7.02 63.08,-1.06 89.72,-1.11 89.72,40.42 -1.93,40.48
  pour Top (rank 2): -1.76,39.64 -1.76,-1.37 -1.73,-1.4 35.83,-1.4 35.83,7.06 35.84,7.07 63.08,7.07 63.08,-1.16 88.78,-1.16 88.77,-1.15 89.6,-1.15 89.6,39.64
IO1_EXIT
  Top 0.254: U3.39 17.91,8.83 R28.1 5.97,11.06 K4.2
IO2_MENU  (via drill 0.35)
  Top 0.254: K3.2 3.58,32.8 4.84,31.55 7.58,28.8 7.58,21.82 12.53,16.87 v14.37,16.87 R27.1 | U3.38 29.81,10.1 29.76,10.05 20.3,10.05 18.42,11.93 v18.42,12.92
  Bottom 0.254: v18.42,12.92 15.47,12.92 14.37,14.01 v14.37,16.87
IO3  (via drill 0.35)
  Top 0.254: U5.1 14.85,26.37 v15.51,27.03 | U3.15 56.45,26.15 55.38,27.22 55.35,27.19 49.7,27.19 v49.19,27.7
  Bottom 0.254: v49.19,27.7 47.93,28.96 17.44,28.96 v15.51,27.03 14.85,26.37 P28.P$1
IO4_DOWN  (via drill 0.35)
  Top 0.254: U3.4 57.99,11.83 56.49,11.83 v56.46,11.8 | R30.1 v14.4,12.52 9.18,12.52 6.45,15.25 K5.1
  Bottom 0.254: v56.46,11.8 56.26,12 56.26,12.02 56.09,12.19 14.73,12.19 v14.4,12.52
IO5_CONF  (via drill 0.35)
  Top 0.254: K5.4 6.37,19.32 11.87,13.82 v13.68,13.82 15.5,13.82 R31.2 | U3.5 56.3,12.64 55.17,11.51 v55.07,11.51
  Bottom 0.254: v55.07,11.51 54.94,11.64 14.33,11.64 13.68,12.29 v13.68,13.82
IO6_UP  (via drill 0.35)
  Top 0.254: v53.23,9.31 53.23,10.77 56.37,13.91 U3.6 | R29.1 v12.87,15.41 12.29,15.41 K5.2
  Bottom 0.254: v53.23,9.31 53.23,9.36 53.21,9.38 14.6,9.38 12.87,11.11 v12.87,15.41
IO7_LCD_3.3_CTL  (via drill 0.35)
  Top 0.254: R18.1 69.24,7.24 v69.1,7.24 | v59.79,11.4 59.79,14.83 59.44,15.18 U3.7
  Bottom 0.254: v69.1,7.24 66.06,7.24 61.9,11.4 v59.79,11.4
IO8  (via drill 0.35)
  Top 0.254: v33.93,34.41 23.38,34.41 16.47,27.5 16.47,22.03 v16.05,21.61 U5.20 | U3.12 56.91,21.53 v56.32,22.13
  Bottom 0.254: v56.32,22.13 57,22.8 57,24.74 56.51,25.22 54.74,25.22 49.03,30.93 49.03,30.95 37.39,30.95 v33.93,34.41 | P20.P$1 16.04,21.61 v16.05,21.61
IO9  (via drill 0.35)
  Top 0.254: U5.2 17.39,26.72 v17.64,26.97 | v48.51,27.01 48.75,26.77 53.29,26.77 53.9,26.16 U3.17
  Bottom 0.254: v48.51,27.01 v48.52,27.02 47.04,28.5 19.17,28.5 v17.64,26.97 17.39,26.72 P29.P$1
IO10_SPI_CS  (via drill 0.35)
  Top 0.254: U3.18 52.63,19.31 v48.8,15.48 | R20.1 28.3,16.87 J1.2 v28.31,12.87
  Bottom 0.254: v48.8,15.48 46.19,12.87 v28.31,12.87 27.67,12.87 27.42,12.62 20.85,12.62 P8.P$1
IO11_SPI_MOSI  (via drill 0.35)
  Top 0.254: U4.14 71.29,17 v71.46,16.83 v71.47,16.83 | v51.34,23.67 51.36,23.69 U3.19
  Bottom 0.254: v51.34,23.67 51.34,21.51 57.43,15.42 71.04,15.42 71.47,15.85 v71.47,16.83 71.42,16.88 70.87,16.88 68.41,19.34 P55.P$1
IO12_SPI_CLK  (via drill 0.35)
  Top 0.254: U4.13 71.92,17.5 72.27,17.15 v72.27,16.37 | v50.13,23.97 50.13,25.53 U3.20
  Bottom 0.254: v72.27,16.37 72.24,16.34 | 72.24,16.34 72.24,15.64 71.61,15.01 56.86,15.01 50.13,21.74 v50.13,23.97 | P54.P$1 69.97,19.27 72.24,17 72.24,16.34
IO13_SPI_MISO  (via drill 0.35)
  Top 0.254: J1.7 v22.8,16 22.82,16.02 R22.1 | U3.21 48.82,19.17 v45.7,16.05
  Bottom 0.254: v22.8,16 23.32,15.49 | 23.32,15.49 24.12,14.68 44.33,14.68 v45.7,16.05 | P11.P$1 23.91,16.08 23.32,15.49
IO14  (via drill 0.35)
  Top 0.254: U3.22 v47.55,27.02 | v19.29,27.34 18.78,26.83 18.78,21.79 v18.5,21.51 17.41,20.42 U5.19
  Bottom 0.254: v47.55,27.02 46.48,28.09 20.05,28.09 v19.3,27.34 v19.29,27.34 | P21.P$1 v18.49,21.51 v18.5,21.51
IO15  (via drill 0.35)
  Top 0.254: v35.85,33.75 26.82,33.75 v20.25,27.18 19.93,26.86 U5.3 | U3.8 57.33,16.45 v57.09,16.69
  Bottom 0.254: v35.85,33.75 35.89,33.79 48.75,33.79 55.7,26.85 57.29,26.85 58.66,25.48 58.66,18.3 57.09,16.73 v57.09,16.69 | P30.P$1 19.93,26.86 v20.25,27.18
IO16  (via drill 0.35)
  Top 0.254: v36.63,33.07 27.69,33.07 21.13,26.51 21.13,21.59 v21.07,21.53 19.96,20.42 U5.18 | U3.9 58.4,17.67 v57.1,17.67
  Bottom 0.254: v36.63,33.07 48.75,33.07 55.38,26.44 57.12,26.44 58.26,25.31 58.26,18.82 v57.1,17.67 | v21.07,21.53 19.96,20.42 P22.P$1
IO17  (via drill 0.35)
  Top 0.254: U3.10 57.39,18.99 v57.11,19.27 | v37.3,32.36 27.97,32.36 v22.77,27.16 22.47,26.86 U5.4
  Bottom 0.254: v37.3,32.36 48.78,32.36 49.04,32.11 55.11,26.03 56.95,26.03 57.85,25.14 57.85,20.12 57.11,19.39 v57.11,19.27 | P31.P$1 22.47,26.86 v22.77,27.16
IO18  (via drill 0.35)
  Top 0.254: v57.09,20.29 57.09,20.26 U3.11 | v37.95,31.7 28.6,31.7 23.65,26.75 23.65,21.55 v23.6,21.5 22.52,20.42 U5.17
  Bottom 0.254: v37.95,31.7 48.87,31.7 48.87,31.69 49.44,31.12 49.44,31.1 54.91,25.63 56.79,25.63 57.44,24.97 57.44,20.65 v57.09,20.29 | v23.6,21.5 P23.P$1
IO19  (via drill 0.35)
  Top 0.254: v37.05,30.32 28.6,30.32 v25.37,27.09 25.01,26.73 U5.5 | U3.13 56.32,22.8 56.28,22.84 v56.28,23.06
  Bottom 0.254: v37.05,30.32 48.82,30.32 54.34,24.8 56.35,24.8 56.56,24.59 56.56,23.34 v56.28,23.06 | P32.P$1 25.01,26.73 v25.37,27.09
IO20  (via drill 0.35)
  Top 0.254: U3.14 58.39,24.01 v55.87,24.01 | v37.82,29.67 29.33,29.67 26.27,26.61 26.27,21.55 v26.17,21.45 25.14,20.42 U5.16
  Bottom 0.254: v55.87,24.01 53.83,24.01 48.18,29.67 v37.82,29.67 | P24.P$1 25.17,20.45 v26.17,21.45
IO21  (via drill 0.35)
  Top 0.254: U3.23 v46.28,27.02 | v28.29,26.98 27.55,26.24 U5.6
  Bottom 0.254: v46.28,27.02 45.62,27.68 28.99,27.68 v28.29,26.98 27.54,26.23 P33.P$1
IO38  (via drill 0.35)
  Top 0.254: U3.31 39.94,18.48 v38.38,18.48 | U5.15 27.54,21.83 v27.81,22.1
  Bottom 0.254: v38.38,18.48 34.08,22.78 28.48,22.78 v27.81,22.11 v27.81,22.1 27.54,21.83 P25.P$1
IO39_SPI_CLK  (via drill 0.35)
  Top 0.254: U3.32 38.56,17.72 37.95,17.11 v37.95,14 | v24.98,13.34 24.98,14.68 J1.5
  Bottom 0.254: v37.95,14 37.46,14 37.24,14.23 25.83,14.23 24.98,13.38 | 24.98,13.38 v24.98,13.34 | P10.P$1 23.11,13.38 24.98,13.38
IO40_SPI_MOSI  (via drill 0.35)
  Top 0.254: R21.1 27.2,15.89 J1.3 27.22,14.68 v27.22,13.36 | v38.86,13.66 38.83,13.69 38.83,14.44 38.36,14.91 38.36,15.9 38.91,16.45 U3.33
  Bottom 0.254: v38.86,13.66 38.55,13.35 37.55,13.35 37.15,13.75 27.61,13.75 v27.22,13.36 27.17,13.42 P9.P$1
IO41_LED  (via drill 0.35)
  Top 0.254: U3.34 39.41,15.18 v39.02,15.57 | v13.75,20.24 13.74,20.26 13.74,27.06 21.75,35.07 34.2,35.07 34.8,34.47 41.3,34.47 R16.1
  Bottom 0.254: v39.02,15.57 38.03,15.57 34.39,19.21 14.16,19.21 13.75,19.62 v13.75,20.24
IO42_TF_3.3_CTL
  Top 0.254: U3.35 40.04,13.91 38.48,12.35 R15.1
IO45_CS  (via drill 0.35)
  Top 0.254: U4.12 69.61,18.02 72.34,18.02 v72.52,17.84 | v48.08,21.7 44.44,21.7 42.45,23.69 U3.26
  Bottom 0.254: v48.08,21.7 49.28,21.7 56.41,14.57 71.77,14.57 72.93,15.73 72.93,17.43 v72.52,17.84 v72.51,17.84 71.58,18.77 P53.P$1
IO46_D/C  (via drill 0.35)
  Top 0.254: U4.11 73.15,18.5 v73.31,18.34 v73.31,18.33 | U3.16 55.17,19.2 54.14,18.17 v54.14,15.72
  Bottom 0.254: v54.14,15.72 54.21,15.72 55.97,13.96 72.07,13.96 73.35,15.24 73.35,18.29 v73.31,18.33 73.31,18.76 70.6,21.47 P52.P$1
IO47_RES  (via drill 0.35)
  Top 0.254: U4.10 73.94,19 v74.07,18.87 | v44.99,23.88 44.99,25.55 U3.24
  Bottom 0.254: v44.99,23.88 44.99,23.72 55.42,13.3 72.25,13.3 73.77,14.82 73.77,17.78 74.07,18.08 v74.07,18.87 74.07,19.14 P51.P$1
IO48_BUSY  (via drill 0.35)
  Top 0.254: U4.9 69.62,19.53 74.7,19.53 v74.77,19.46 | v43.69,23.91 43.74,23.96 U3.25
  Bottom 0.254: v43.69,23.91 54.81,12.79 72.58,12.79 74.18,14.39 74.18,17.58 74.77,18.17 v74.77,19.46 73.61,20.62 P50.P$1
LCD_GND  (via drill 0.35)
  Top 0.254: U4.6 75.27,21.01 75.66,20.62 | 75.66,20.62 76.5,20.62 C23.2 77.03,21.38 | U4.17 70.89,15.5 70.91,15.48 72.36,15.48 v76.27,19.39 | 75.66,20.62 75.56,20.62 v75.33,20.84 | 75.75,10.92 75.52,10.92 | 78.17,22.52 D5.C
  Top 0.3: U4.6 U4.7 U4.8
  Top 0.4: 75.75,10.92 76.58,10.92 76.96,11.3 C28.2 | 77.03,21.38 78.17,22.52
  Top 0.5: C28.2 C20.2 C27.2 C29.2 C26.2 C25.2 76.95,18.71 v76.27,19.39 | C22.2 64.13,25.11 v64.16,25.14 | Q9.3 74.06,8.27 74.33,8.54 74.33,9.73 75.52,10.92 | D5.C v78.17,24.1
  Bottom 0.5: v64.16,25.14 65.59,25.14 | 65.59,25.14 77.13,25.14 v78.17,24.1 v78.16,24.09 P68.P$1 | v75.33,20.84 76.27,19.9 v76.27,19.39 | P43.P$1 65.59,25.14
  pour Top: 67.64,21.54 67.64,19.94 70.24,19.94 70.56,20.26 70.56,21.09 69.01,21.09 68.56,21.54
N$1
  Top 0.254: R7.2 80.94,12.76 80.94,11.64 80.62,11.32 78.58,11.32 78.1,11.8 Q1.1
N$2
  Top 0.254: U1.2 62.84,15.73 63.8,15.73 65.24,14.29 65.24,7.69 66.4,6.53 68.31,6.53 R5.2
N$3
  Top 0.254: U1.3 63.9,14.48 64.74,13.63 64.74,7.52 R6.2
N$4
  Top 0.254: R8.2 80.82,15.27 Q2.1
N$5
  Top 0.254: J2.A5 79.44,5.18 R1.2
N$6  (via drill 0.35)
  Top 0.254: v71.49,26.68 71.78,26.97 R11.1 R10.2 | Q3.1 79.74,29.69 v79.69,29.69
  Bottom 0.254: v71.49,26.68 76.68,26.68 v79.69,29.69
N$7
  Top 0.254: R18.2 Q9.1
N$8
  Top 0.254: Q10.1 36.75,14.77 R15.2
N$9
  Top 0.254: R13.1 R14.2 62.29,34.48 63.26,34.48 U2.5
N$10
  Top 0.254: R19.1 29.35,14.75 J1.1
N$11
  Top 0.6: U2.3 65.22,28.77 L1.P$1
N$12
  Top 0.254: J2.B5 79.58,8.18 R4.1
N$13
  Top 0.254: U1.4 62.62,13.21 61.76,14.06 61.76,17.43 62.07,17.73 63.86,17.73 64.17,18.04 C15.2
N$16
  Top 0.254: U6.5 82.49,20.06 R12.2
N$20
  Top 0.254: R23.1 J1.8
N$25
  Top 0.254: R16.2 45.26,33.51 46.88,33.51 47.46,34.09 D1.+ R17.2
N$55  (via drill 0.35)
  Top 0.254: C21.1 64.84,22.7 64.84,25.72 v65.16,26.04 | v74.76,25.94 75.27,26.45 D4.C 78.15,26.45 D5.A
  Bottom 0.254: v65.16,26.04 65.19,26.01 74.69,26.01 v74.76,25.94
N$56  (via drill 0.35)
  Top 0.254: D6.A 77.83,20.79 77.2,20.16 70.98,20.16 v70.95,20.19 | L2.2 63.6,20.84 64.32,20.12 v65.35,20.12
  Top 0.5: C21.2 62.87,21.05 L2.2 62.93,20.84 63.65,20.12 Q4.3
  Bottom 0.254: v65.35,20.12 65.42,20.19 v70.95,20.19
  pour Top: 62.91,20.92 63.45,20.38 63.45,19.14 65.83,19.14 65.84,19.13 65.84,21.11 65.81,21.14 63.12,21.14 62.91,20.93
PREVGH  (via drill 0.35)
  Top 0.254: U4.21 74.13,13.5 75.92,15.29 C29.1 76.09,15.33 v76.09,16.09 | v78.31,15.76 78.31,16.91 D6.C
  Bottom 0.254: v78.31,15.76 77.96,16.11 76.35,16.11 76.33,16.09 v76.09,16.09 76.09,14.92 P56.P$1
PREVGL  (via drill 0.35)
  Top 0.254: U4.23 75.99,12.51 C20.1 76.04,12.6 v76.04,13.43 | v75.16,22.65 D4.A
  Bottom 0.254: v76.04,13.43 77.62,15.01 78.74,15.01 78.75,15.02 | 78.75,15.02 79.2,15.47 79.2,18.61 v75.16,22.65 | P57.P$1 79.3,14.46 78.75,15.02
RESE  (via drill 0.35)
  Top 0.254: v62.73,18.45 62.67,18.51 Q4.2 | v67.13,22.21 R24.2 68.31,22.5 U4.3
  Bottom 0.254: v62.73,18.45 66.49,22.21 v67.13,22.21 67.08,22.16 P67.P$1
RTS  (via drill 0.35)
  Top 0.254: U1.14 67.39,14.48 65.93,13.02 v65.93,11.33 | Q1.2 79.96,12.18 v79.03,13.1 79.21,13.28 80.32,13.28 R8.1
  Bottom 0.254: v65.93,11.33 66.58,11.33 67.56,10.35 75.8,10.35 76.15,10.7 78.55,13.1 v79.03,13.1
TF_GND  (via drill 0.35)
  Top 0.5: C18.1 | C18.1 C17.1 | C18.1 33.58,16.27 C19.2 34.72,16.28 Q10.3 v34.99,17.09
  Top 0.7: J1.6 23.9,12.93 24.91,11.92 30.74,11.92 31.38,12.56 C17.1
  Bottom 0.5: v34.99,17.09 34.22,17.86 P45.P$1
USB_D+  (via drill 0.35)
  Top 0.254: R3.2 75.56,9.17 v75.54,9.19 | v64.08,11.38 63.38,11.38 U1.5
  Bottom 0.254: v75.54,9.19 75.45,9.1 73.51,9.1 | 73.51,9.1 66.35,9.1 v64.08,11.37 v64.08,11.38 | P4.P$1 73.51,9.1
USB_D-  (via drill 0.35)
  Top 0.254: R2.2 75.67,8.1 v75.54,8.23 | v64.08,10.16 63.33,10.16 U1.6
  Bottom 0.254: v75.54,8.23 73.56,8.23 | 73.56,8.23 66.01,8.23 v64.08,10.16 | P3.P$1 73.56,8.23
VBUS  (via drill 0.35)
  Top 0.254: 81.94,8.83 81.13,8.83 J2.B4 | J2.B4 J2.A9 | J2.A4 J2.B9 | J2.A4 81.11,4.01 81.96,4.01 | J2.A4 80.85,4.01 80.04,4.01 79.55,3.52 79.55,1.97 78.25,0.67 68.98,0.67 | R34.2 63.66,3.59 63.66,2.71 65.7,0.67 68.98,0.67 | R35.2 68.99,0.68 68.98,0.67 | J2.B4 80.83,8.83 80.11,8.83
  Top 0.5: 81.96,4.01 82.87,4.92 | 82.87,7.9 81.94,8.83 | C4.2 80.49,20.06 U6.4 | R10.1 69.71,27.35 69.71,24.5 v69.53,24.32 68.89,24.96 D2.A 67.98,24.96 66.28,23.26 66.28,19.18 67.04,18.42 C1.1 67.04,17.56 67.59,17.02 U1.16
  Top 0.6: C4.2 80.4,18.97 v80.35,18.92 | v78.6,10.62 78.6,10.22 79.99,8.83 80.11,8.83
  Top 0.8: 82.87,4.92 82.87,7.9
  Bottom 0.5: v80.35,18.92 74.95,24.32 v69.53,24.32 | P2.P$1 81.48,13.43 80.34,13.43
  Bottom 0.6: v78.6,10.62 78.6,11.27 80.34,13.01 80.34,13.43 v80.34,18.91 v80.35,18.92
VCOM  (via drill 0.35)
  Top 0.254: C28.1 76.05,11.58 75.61,12.02 74.72,12.02 | 74.72,12.02 74.13,12.02 69.61,12.02 U4.24 | 74.72,12.02 74.76,11.98 v74.76,11.26
  Bottom 0.254: v74.76,11.26 73.58,11.26 P73.P$1
VDD  (via drill 0.35)
  Top 0.254: U4.18 72.63,15 75.01,17.38 | C25.1 75.85,18.22 75.01,17.38 | 75.01,17.38 v75.13,17.26
  Bottom 0.254: v75.13,17.26 77.23,19.36 P70.P$1
VDHR  (via drill 0.35)
  Top 0.254: C23.1 75.78,21.5 71.29,21.5 | 71.29,21.5 U4.5 | 71.29,21.5 71.29,22.3 v71.62,22.63
  Bottom 0.254: v71.62,22.63 v71.62,22.64 P58.P$1
VIN  (via drill 0.35)
  Top 0.5: Q3.2 78.35,30.3 74.82,30.3 D3.C | C7.2 66.73,29.22 v68.04,30.53 | v68.14,34.63 68.19,34.68 67.6,35.27 65.62,35.27 65.22,34.87 U2.4 64.71,34.42 63.32,33.03 U2.1
  Top 0.6: D2.C C7.2
  Top 1: D3.C 68.38,28.84 D2.C
  Bottom 0.5: v68.04,30.53 68.21,30.7 68.21,34.56 v68.14,34.63
VSH  (via drill 0.35)
  Top 0.254: C26.1 76.05,17.13 v74.93,16.01 72.91,13.99 U4.20
  Bottom 0.254: v74.93,16.01 76.44,17.52 P71.P$1
VSL  (via drill 0.35)
  Top 0.254: C27.1 75.76,14.23 75.03,13.5 | 75.03,13.5 74.53,13 U4.22 | v75.04,13.48 75.03,13.5
  Bottom 0.254: P72.P$1 74.64,13.11 75.01,13.48 v75.04,13.48

### Text on the board
tPlace: - | IO2 | GND | GND | GND | + | IO3 | IO9 | IO15 | IO17 | IO19 | IO21 | GND | 3V3 | 3V3 | 3V3 | IO8 | 3V3 | IO14 | IO16 | IO18 | IO20 | IO38 | V1.0 | IO6 / IO5 / IO4 | IO42 | SKU:DIE01129S | ESP32 Display-2.9(E) inch | IO7 | IO1 | IO10 => SPI_CS / IO40 => SPI_MOSI / IO39 => SPI_CLK / IO13 => SPI_MISO